# Altium schematic sheet DigitalCarrierPlug.SchDoc
size A4; CompanyName: Technische Hochschule Nürnberg Georg Simon Ohm; Address1: Fürther Straße 250; Address2: 90429 Nürnberg; Address3: GERMANY; DocumentNumber: 14; SheetNumber: 14; SheetTotal: 16; CompanyName2: Institut ELSYS
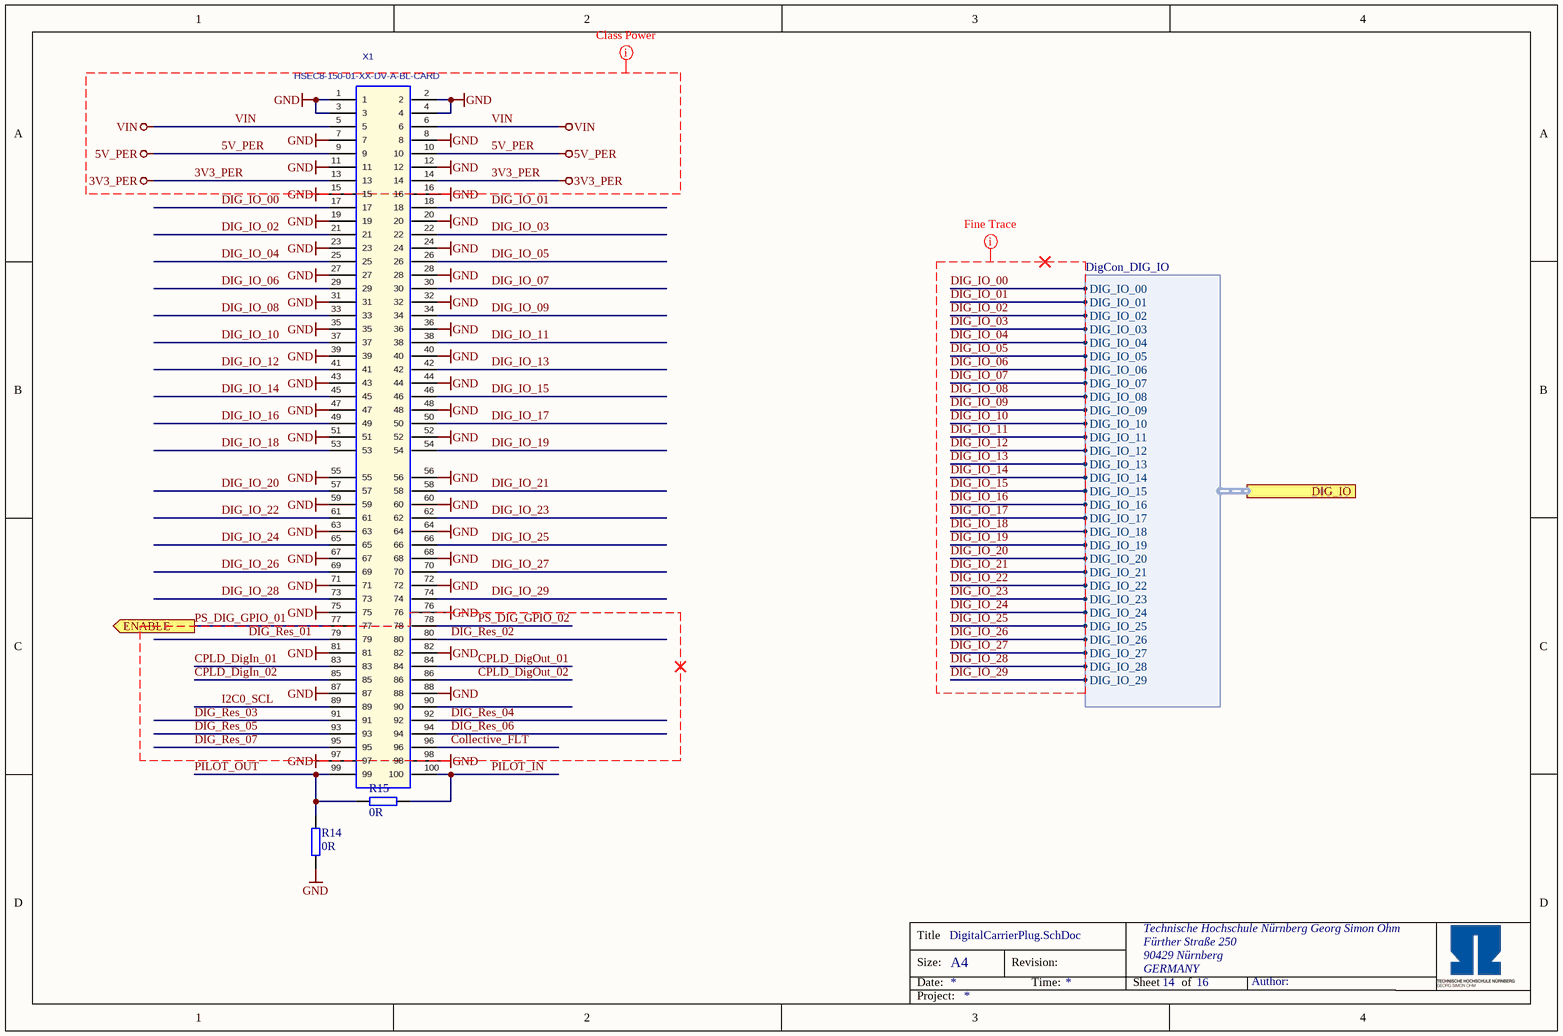
[diagram p0: DigitalCarrierPlug.SchDoc]

## Parts
R14  0R  [RES 0603_1608]
R15  0R  [RES 0603_1608]
X1  HSEC8-150-01-XX-DV-A-BL-CARD  [HSEC8-150-01-XX-DV-A-BL-CARD]  (no BOM)

## Ports
DIG_IO (harness DigCon_DIG_IO), ENABLE (out)

## Harnesses
DigCon_DIG_IO: DIG_IO_00, DIG_IO_01, DIG_IO_02, DIG_IO_03, DIG_IO_04, DIG_IO_05, DIG_IO_06, DIG_IO_07, DIG_IO_08, DIG_IO_09, DIG_IO_10, DIG_IO_11, DIG_IO_12, DIG_IO_13, DIG_IO_14, DIG_IO_15, DIG_IO_16, DIG_IO_17, DIG_IO_18, DIG_IO_19, DIG_IO_20, DIG_IO_21, DIG_IO_22, DIG_IO_23, DIG_IO_24, DIG_IO_25, DIG_IO_26, DIG_IO_27, DIG_IO_28, DIG_IO_29

## Nets
3V3_PER: X1.13 X1.14
5V_PER: X1.9 X1.10
GND: R14.1 X1.1 X1.2 X1.3 X1.4 X1.7 X1.8 X1.11 X1.12 X1.15 X1.16 X1.19 X1.20 X1.23 X1.24 X1.27 X1.28 X1.31 X1.32 X1.35 X1.36 X1.39 X1.40 X1.43 X1.44 X1.47 X1.48 X1.51 X1.52 X1.55 X1.56 X1.59 X1.60 X1.63 X1.64 X1.67 X1.68 X1.71 X1.72 X1.75 X1.76 X1.81 X1.82 X1.87 X1.88 X1.97 X1.98
VIN: X1.5 X1.6
Collective_FLT: X1.96
CPLD_DigIn_01: X1.83
CPLD_DigIn_02: X1.85
CPLD_DigOut_01: X1.84
CPLD_DigOut_02: X1.86
DIG_IO_00: X1.17 ; port DIG_IO.DIG_IO_00
DIG_IO_01: X1.18 ; port DIG_IO.DIG_IO_01
DIG_IO_02: X1.21 ; port DIG_IO.DIG_IO_02
DIG_IO_03: X1.22 ; port DIG_IO.DIG_IO_03
DIG_IO_04: X1.25 ; port DIG_IO.DIG_IO_04
DIG_IO_05: X1.26 ; port DIG_IO.DIG_IO_05
DIG_IO_06: X1.29 ; port DIG_IO.DIG_IO_06
DIG_IO_07: X1.30 ; port DIG_IO.DIG_IO_07
DIG_IO_08: X1.33 ; port DIG_IO.DIG_IO_08
DIG_IO_09: X1.34 ; port DIG_IO.DIG_IO_09
DIG_IO_10: X1.37 ; port DIG_IO.DIG_IO_10
DIG_IO_11: X1.38 ; port DIG_IO.DIG_IO_11
DIG_IO_12: X1.41 ; port DIG_IO.DIG_IO_12
DIG_IO_13: X1.42 ; port DIG_IO.DIG_IO_13
DIG_IO_14: X1.45 ; port DIG_IO.DIG_IO_14
DIG_IO_15: X1.46 ; port DIG_IO.DIG_IO_15
DIG_IO_16: X1.49 ; port DIG_IO.DIG_IO_16
DIG_IO_17: X1.50 ; port DIG_IO.DIG_IO_17
DIG_IO_18: X1.53 ; port DIG_IO.DIG_IO_18
DIG_IO_19: X1.54 ; port DIG_IO.DIG_IO_19
DIG_IO_20: X1.57 ; port DIG_IO.DIG_IO_20
DIG_IO_21: X1.58 ; port DIG_IO.DIG_IO_21
DIG_IO_22: X1.61 ; port DIG_IO.DIG_IO_22
DIG_IO_23: X1.62 ; port DIG_IO.DIG_IO_23
DIG_IO_24: X1.65 ; port DIG_IO.DIG_IO_24
DIG_IO_25: X1.66 ; port DIG_IO.DIG_IO_25
DIG_IO_26: X1.69 ; port DIG_IO.DIG_IO_26
DIG_IO_27: X1.70 ; port DIG_IO.DIG_IO_27
DIG_IO_28: X1.73 ; port DIG_IO.DIG_IO_28
DIG_IO_29: X1.74 ; port DIG_IO.DIG_IO_29
DIG_Res_01: X1.79
DIG_Res_02: X1.80
DIG_Res_03: X1.91
DIG_Res_04: X1.92
DIG_Res_05: X1.93
DIG_Res_06: X1.94
DIG_Res_07: X1.95
I2C0_SCL: X1.89
PILOT_IN: R15.1 X1.100
PILOT_OUT: R14.2 R15.2 X1.99
PS_DIG_GPIO_01: X1.77 ; port ENABLE
PS_DIG_GPIO_02: X1.78

Not connected (* = marked no-connect by the designer): X1 90

## Layout directives
net class Power: 3V3_PER, 5V_PER, GND, VIN
net class Fine Trace: DIG_IO_00, DIG_IO_01, DIG_IO_02, DIG_IO_03, DIG_IO_04, DIG_IO_05, DIG_IO_06, DIG_IO_07, DIG_IO_08, DIG_IO_09, DIG_IO_10, DIG_IO_11, DIG_IO_12, DIG_IO_13, DIG_IO_14, DIG_IO_15, DIG_IO_16, DIG_IO_17, DIG_IO_18, DIG_IO_19, DIG_IO_20, DIG_IO_21, DIG_IO_22, DIG_IO_23, DIG_IO_24, DIG_IO_25, DIG_IO_26, DIG_IO_27, DIG_IO_28, DIG_IO_29

## Notes on the sheet
- Title
- Size:
- Date:
- A4
- Revision:
- Time:
- Sheet
- of
- Author:
- Project:

## Library data of the parts
R14 R15 = RC0603JR-070RL: SMD resistor E24 series; Manufacturer: YAGEO; Tolerance: 5%; Created from: MGremer; Manufacturer Part Number: RC0603JR-070RL; PartID: 1; Created On: 14.12.2020 16:17:14; ComponentLink1Description: Datasheet; ComponentLink1URL: https://www.mouser.de/datasheet/2/447/PYu-RC_Group_51_RoHS_L_10-1664068.pdf; Component Type: SMD resistor; Device Package: 0603; Last Updated: 04.03.2021 09:09:42; Mounting Type: SMD; Supplier 1: Mouser; Supplier Part Number 1: 603-RC0603JR-070RL; Type: Resistor; Value: 0R; Live Cycle Status: 1; LCSC Part Number: C21189; Stock number: Labor SMD Container; Supplier 2: LCSC; Supplier Part Number 2: C21189
X1 = HSEC8-150-01-XX-DV-A-BL-CARD: Mating Card Layout for HSEC8-150-01-XX-DV-A-BL; Manufacturer: SAMTEC; Created from: T. Wendt; Number of positions: 100; Created: 2018_04_23_AGeiger; Category: SAMTEC; Manufacturer Part Number: HSEC8-150-01-XX-DV-A-BL-CARD; PartID: 2; Created On: 26.02.2021 16:36:12; ComponentLink1Description: Homepage; ComponentLink1URL: https://www.samtec.com/products/hsec8-dp; Component Type: Board to Board Connector; Device Package: PCB Shape; Last Updated: 26.02.2021 16:37:20; Mounting Type: PCB Shape; Series: HSEC8; Supplier 1: SAMTEC; Supplier Part Number 1: NA; Type: Board to Board Connector; Live Cycle Status: 1; Stock number: not stored; Number of rows: 2